# EasyEDA schematic WordClock_SCH_easyEDA.json
TITLE: The WordClock; REV: 1.0; Date: 2020-02-28; Sheet: 1/1; Drawn By: mattudakis; Company: Your Company
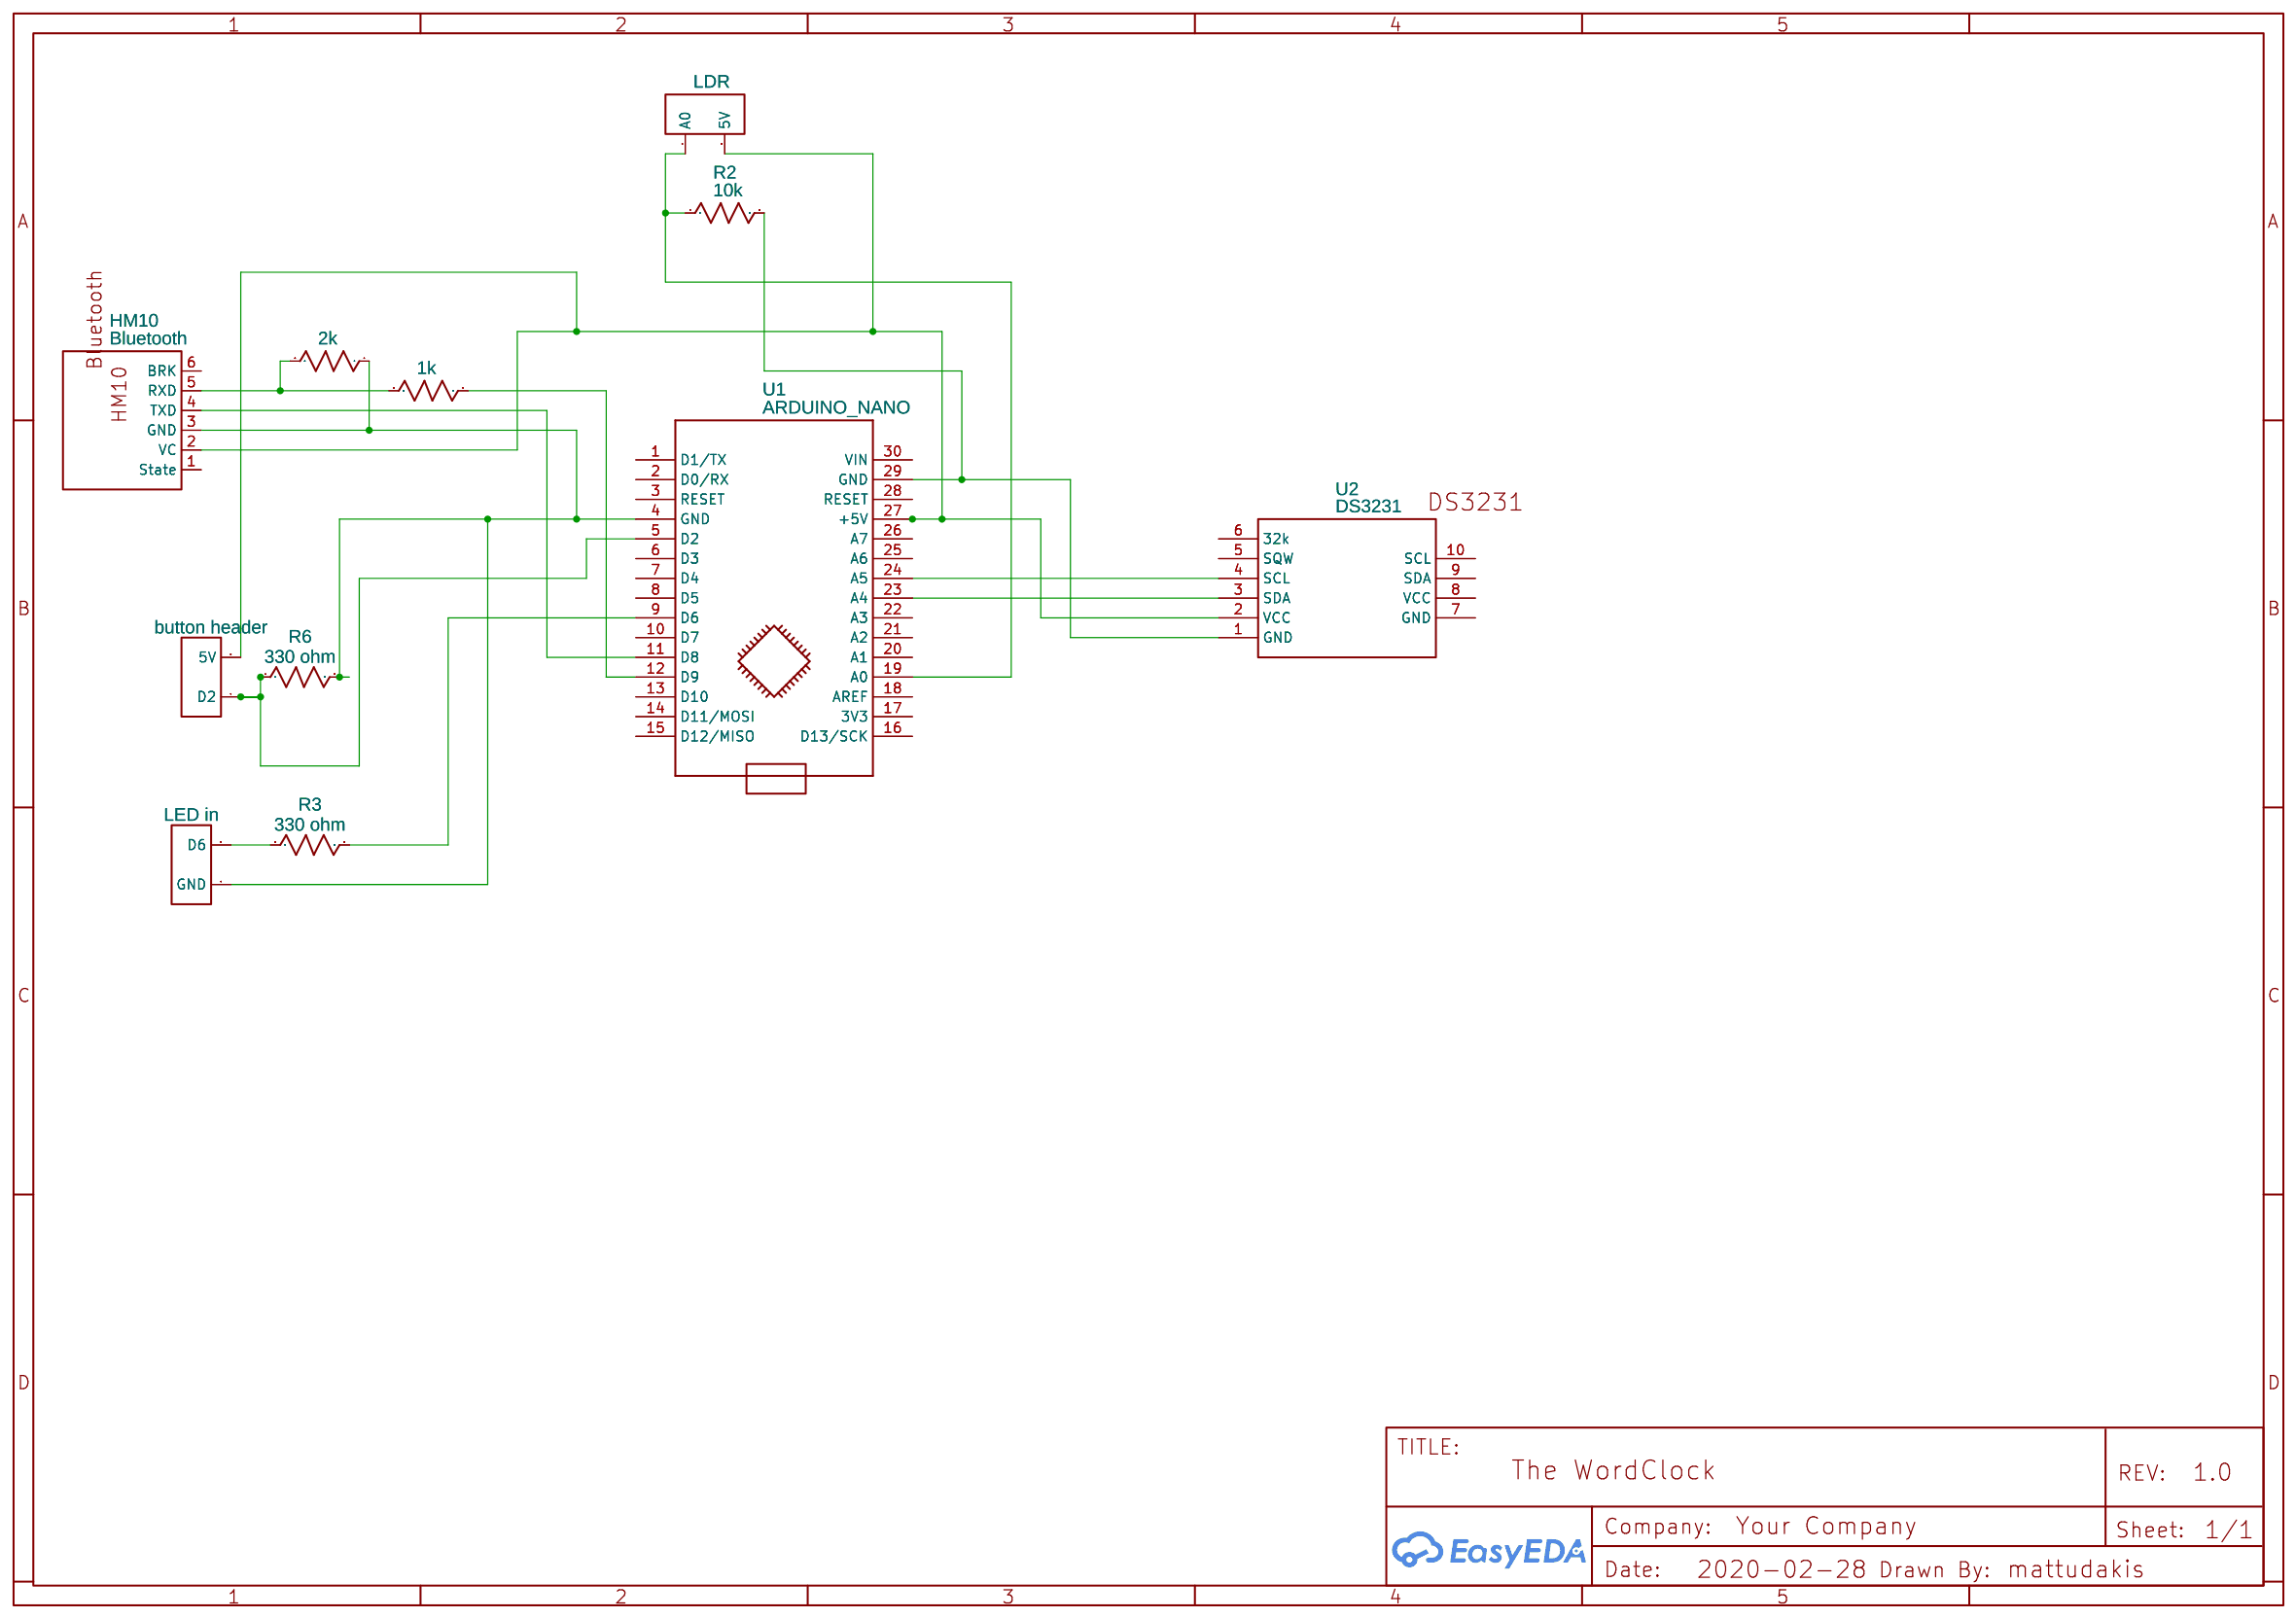
[diagram p0: schematic sheet]

## Parts
H1  button header  [HDR-2X1/2.54]
H2  LED in  [HDR-2X1/2.54]
H3  LDR  [HDR-2X1/2.54]
HM10  Bluetooth  [BLUETOOTH HC05 HM10]
R2  10k  [AXIAL-0.5]
R3  330 ohm  [AXIAL-0.5]
R4  2k  [AXIAL-0.5]
R5  1k  [AXIAL-0.5]
R6  330 ohm  [AXIAL-0.5]
U1  ARDUINO_NANO  [ARDUINO_NANO]
U2  DS3231  [DS3231]

## Library data of the parts
H1-H3 = Header-Male-2.54_1x2: Supplier: LCSC; Manufacturer: TE Connectivity; Manufacturer Part: 826629-2; image: //image.lceda.cn/szlcsc/C86471.jpg; Supplier Part: C86471
HM10 = Bluetooth
R2-R6 = Res_AXIAL-0.5(1/2W)_US
U1 = ARDUINO_NANO: sourceId: KGSeAWhDB
U2 = DS3231: Contributor: ismifaizul

## Nets
Net-(H1-1): H1.1(D2) R6.1 U1.5(D2)
Net-(H1-2): H1.2(5V) H3.2(5V) HM10.2(VC) U1.27(+5V) U2.2(VCC)
Net-(H2-1): H2.1(GND) HM10.3(GND) R4.1 R6.2 U1.4(GND)
Net-(H2-2): H2.2(D6) R3.1
Net-(H3-1): H3.1(A0) R2.1 U1.19(A0)
Net-(HM10-4): HM10.4(TXD) U1.11(D8)
Net-(HM10-5): HM10.5(RXD) R4.2 R5.2
Net-(R2-2): R2.2 U1.29(GND) U2.1(GND)
Net-(R3-2): R3.2 U1.9(D6)
Net-(R5-1): R5.1 U1.12(D9)
Net-(U1-23): U1.23(A4) U2.3(SDA)
Net-(U1-24): U1.24(A5) U2.4(SCL)

Not connected (* = marked no-connect by the designer): HM10 1(State) 6(BRK); U1 1(D1/TX) 2(D0/RX) 3(RESET) 6(D3) 7(D4) 8(D5) 10(D7) 13(D10) 14(D11/MOSI) 15(D12/MISO) 16(D13/SCK) 17(3V3) 18(AREF) 20(A1) 21(A2) 22(A3) 25(A6) 26(A7) 28(RESET) 30(VIN); U2 5(SQW) 6(32k) 7(GND) 8(VCC) 9(SDA) 10(SCL)
